# Altium schematic sheet 產學sheet1VS2.SchDoc
size A3
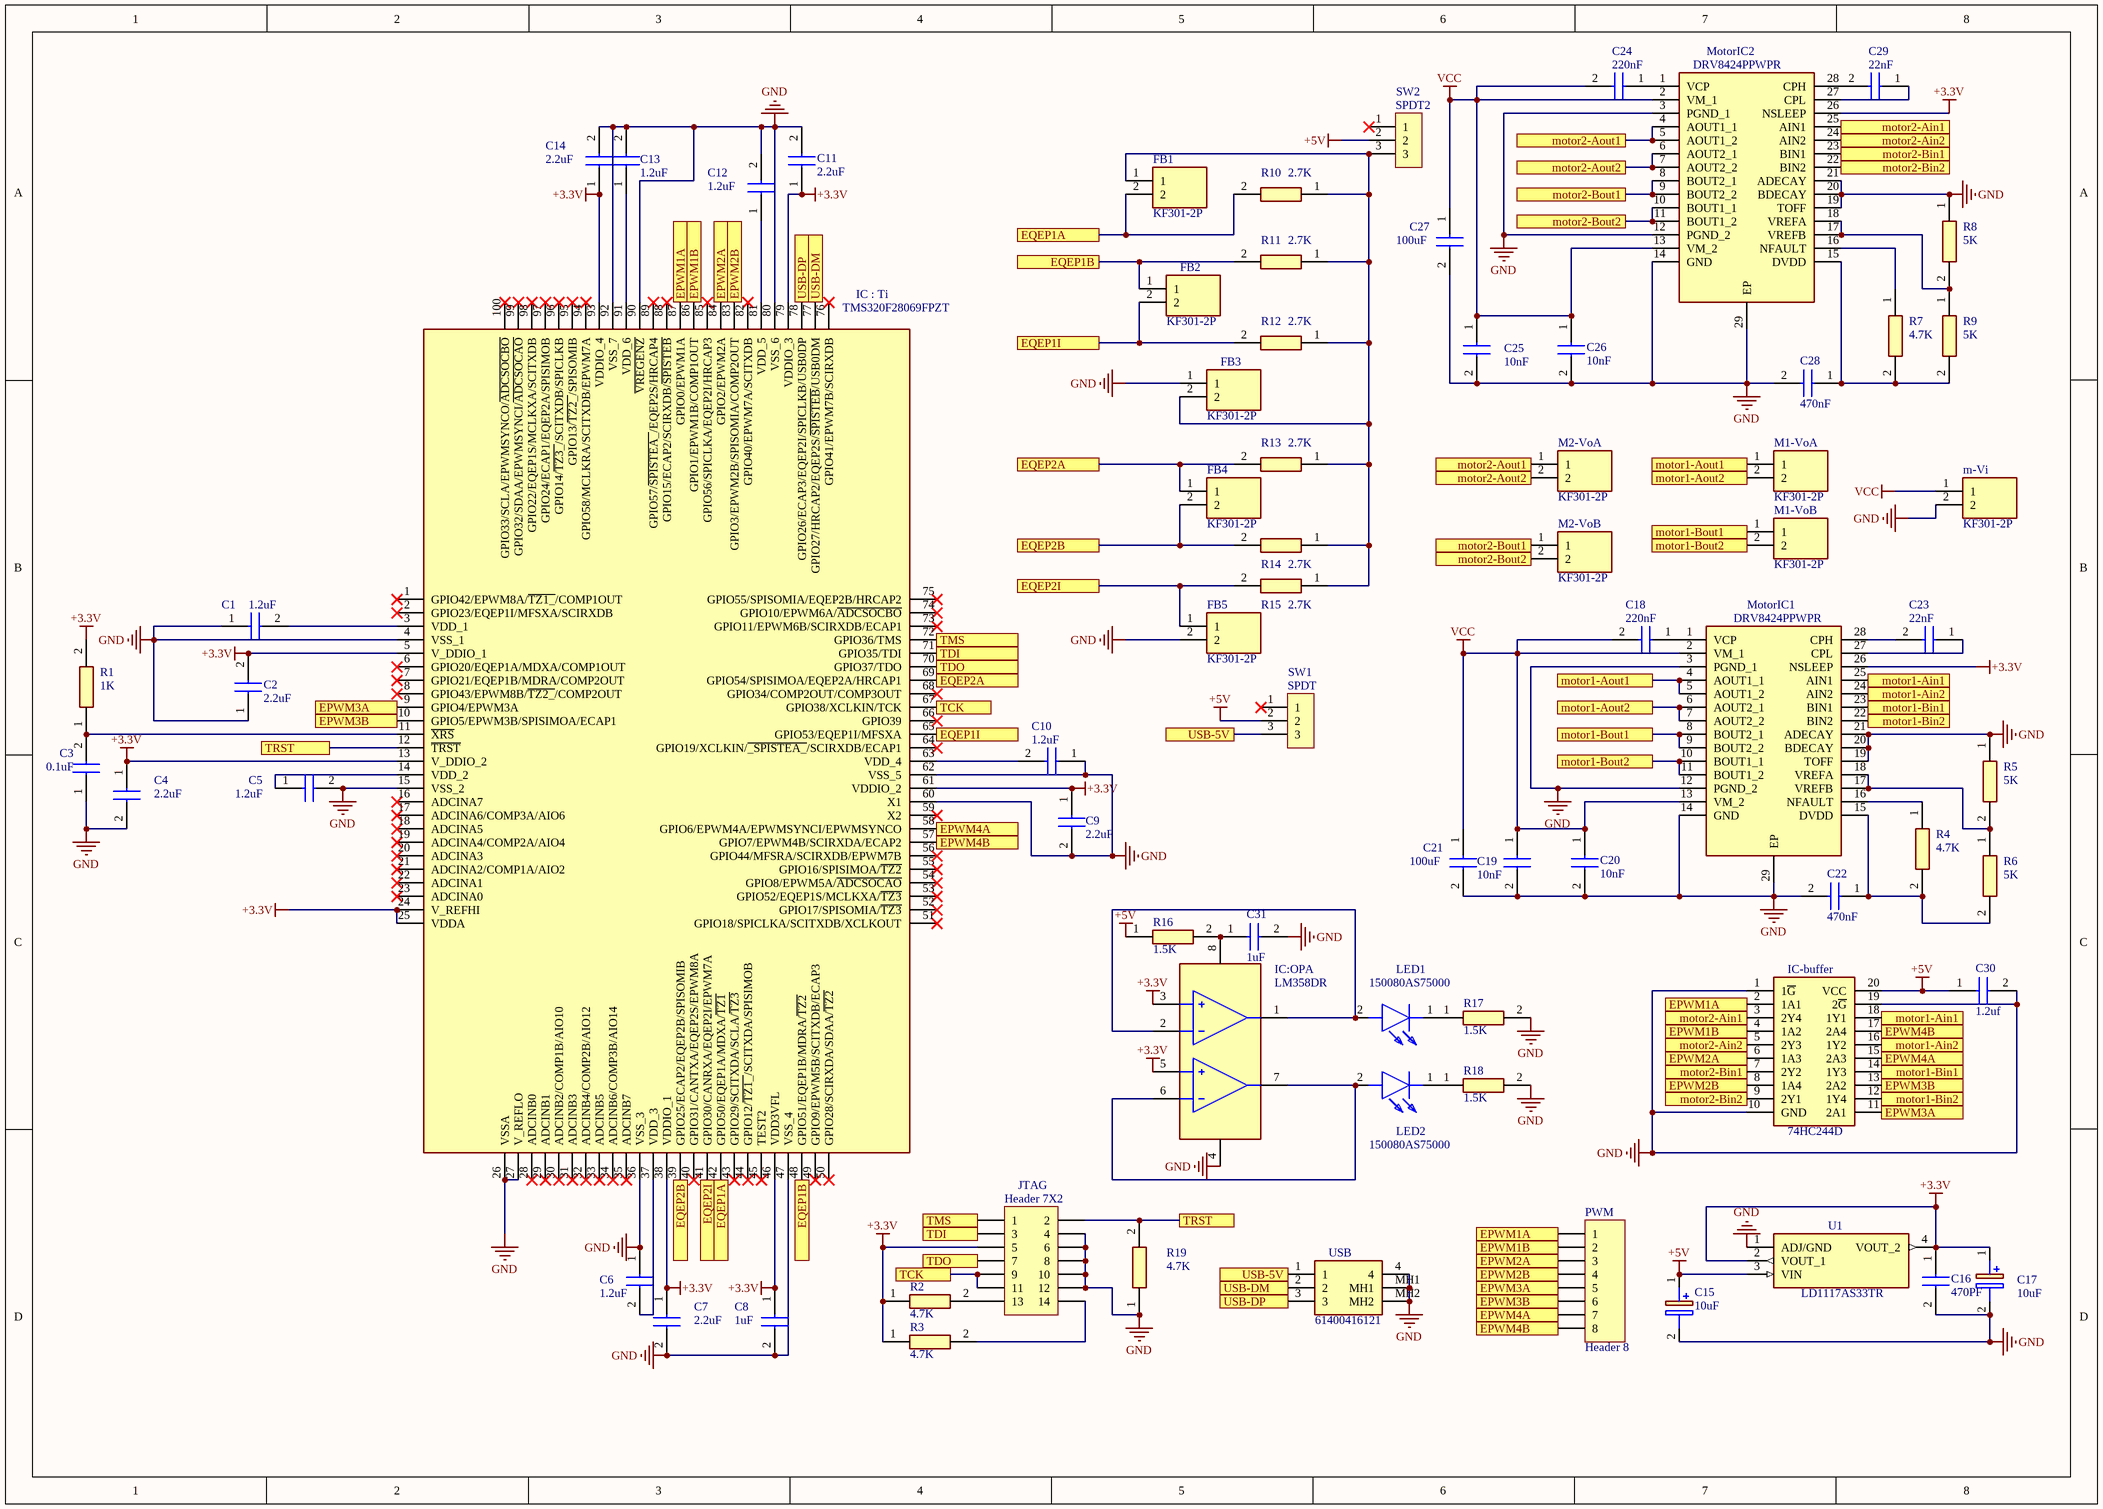
[diagram p0: 產學sheet1VS2.SchDoc]

## Parts
C1  1.2uF  [CAPC2012X140N]
C2  2.2uF  [CAPC2012X140N]
C3  0.1uF  [CAPC2012X140N]
C4  2.2uF  [CAPC2012X140N]
C5  1.2uF  [CAPC2012X140N]
C6  1.2uF  [CAPC2012X140N]
C7  2.2uF  [CAPC2012X140N]
C8  1uF  [C1206]
C9  2.2uF  [CAPC2012X140N]
C10  1.2uF  [CAPC2012X140N]
C11  2.2uF  [CAPC2012X140N]
C12  1.2uF  [CAPC2012X140N]
C13  1.2uF  [CAPC2012X140N]
C14  2.2uF  [CAPC2012X140N]
C15  10uF  [EEE0GA101SR]
C16  470PF  [CAPC2012X140N]
C17  10uF  [EEE0GA101SR]
C18  220nF  [CAPC2012X140N]
C19  10nF  [CAPC2012X140N]
C20  10nF  [CAPC2012X140N]
C21  100uF  [CAPAE1030X1050N]
C22  470nF  [CAPC2012X140N]
C23  22nF  [CAPC2012X140N]
C24  220nF  [CAPC2012X140N]
C25  10nF  [CAPC2012X140N]
C26  10nF  [CAPC2012X140N]
C27  100uF  [CAPAE1030X1050N]
C28  470nF  [CAPC2012X140N]
C29  22nF  [CAPC2012X140N]
C30  1.2uf  [CAPC2012X140N]
C31  1uF  [C1206]
FB1  KF301-2P  [KF3012P]
FB2  KF301-2P  [KF3012P]
FB3  KF301-2P  [KF3012P]
FB4  KF301-2P  [KF3012P]
FB5  KF301-2P  [KF3012P]
IC-buffer  74HC244D  [SOIC127P1030X250-20N]
IC:OPA  LM358DR  [SOIC127P600X175-8N]
IC_:_Ti  TMS320F28069FPZT  [QFP50P1600X1600X160-100N]
JTAG  Header 7X2  [HDR2X7]
LED1  150080AS75000  [LEDC2012X80N]
LED2  150080AS75000  [LEDC2012X80N]
M1-VoA  KF301-2P  [KF3012P]
M1-VoB  KF301-2P  [KF3012P]
M2-VoA  KF301-2P  [KF3012P]
M2-VoB  KF301-2P  [KF3012P]
m-Vi  KF301-2P  [KF3012P]
MotorIC1  DRV8424PPWPR  [SOP65P640X120-29N]
MotorIC2  DRV8424PPWPR  [SOP65P640X120-29N]
PWM  Header 8  [HDR1X8]
R1  1K  [RESC2013X65N]
R2  4.7K  [RESC2013X65N]
R3  4.7K  [RESC2013X65N]
R4  4.7K  [RESC2013X65N]
R5  5K  [RESC2013X65N]
R6  5K  [RESC2013X65N]
R7  4.7K  [RESC2013X65N]
R8  5K  [RESC2013X65N]
R9  5K  [RESC2013X65N]
R10  2.7K  [RESC2013X65N]
R11  2.7K  [RESC2013X65N]
R12  2.7K  [RESC2013X65N]
R13  2.7K  [RESC2013X65N]
R14  2.7K  [RESC2013X65N]
R15  2.7K  [RESC2013X65N]
R16  1.5K  [RESC2013X65N]
R17  1.5K  [RESC2013X65N]
R18  1.5K  [RESC2013X65N]
R19  4.7K  [RESC2013X65N]
SPDT  SW1  [PCBComponent_1]
SPDT2  SW2  [PCBComponent_1]
U1  LD1117AS33TR  [SOT230P700X190-4N]
USB  61400416121  [61400416121]

## Ports
EPWM1A, EPWM1B, EPWM2A, EPWM2B, EPWM3A, EPWM3B, EPWM4A, EPWM4B, EQEP1A, EQEP1B, EQEP1I, EQEP2A, EQEP2B, EQEP2I, motor1-Ain1, motor1-Ain2, motor1-Aout1, motor1-Aout2, motor1-Bin1, motor1-Bin2, motor1-Bout1, motor1-Bout2, motor2-Ain1, motor2-Ain2, motor2-Aout1, motor2-Aout2, motor2-Bin1, motor2-Bin2, motor2-Bout1, motor2-Bout2, TCK, TDI, TDO, TMS, TRST, USB-5V, USB-DM, USB-DP

## Nets
+3.3V: C2.2 C4.1 C7.1 C8.1 C9.1 C11.1 C14.1 C16.1 C17.1(+) IC:OPA.3(IN1+) IC:OPA.5(IN2+) IC_:_Ti.5(V_DDIO_1) IC_:_Ti.13(V_DDIO_2) IC_:_Ti.24(V_REFHI) IC_:_Ti.25(VDDA) IC_:_Ti.38(VDDIO_1) IC_:_Ti.46(VDD3VFL) IC_:_Ti.61(VDDIO_2) IC_:_Ti.79(VDDIO_3) IC_:_Ti.93(VDDIO_4) JTAG.5 MotorIC1.26(NSLEEP) MotorIC2.26(NSLEEP) R1.2(R2) R2.1(R1) R3.1(R1) U1.2(VOUT_1) U1.4(VOUT_2)
+5V: C15.1(+) C30.1 IC-buffer.20(VCC) R16.1(R1) SPDT.2 SPDT2.2 U1.3(VIN)
GND: C1.1 C2.1 C3.1 C4.2 C5.2 C6.1 C7.2 C8.2 C9.2 C10.1 C11.2 C12.2 C13.2 C14.2 C15.2(-) C16.2 C17.2(-) C19.2 C20.2 C21.2(-) C22.2 C25.2 C26.2 C27.2(-) C28.2 C30.2 C31.2 FB3.1 FB5.2 IC-buffer.1(1~{G}) IC-buffer.10(GND) IC-buffer.19(2~{G}) IC:OPA.4(V-) IC_:_Ti.4(VSS_1) IC_:_Ti.15(VSS_2) IC_:_Ti.26(VSSA) IC_:_Ti.27(V_REFLO) IC_:_Ti.36(VSS_3) IC_:_Ti.47(VSS_4) IC_:_Ti.60(X1) IC_:_Ti.62(VSS_5) IC_:_Ti.80(VSS_6) IC_:_Ti.90(~{VREGENZ}) IC_:_Ti.92(VSS_7) JTAG.4 JTAG.6 JTAG.8 JTAG.10 JTAG.12 m-Vi.2 MotorIC1.3(PGND_1) MotorIC1.12(PGND_2) MotorIC1.14(GND) MotorIC1.19(TOFF) MotorIC1.20(BDECAY) MotorIC1.21(ADECAY) MotorIC1.29(EP) MotorIC2.3(PGND_1) MotorIC2.12(PGND_2) MotorIC2.14(GND) MotorIC2.19(TOFF) MotorIC2.20(BDECAY) MotorIC2.21(ADECAY) MotorIC2.29(EP) R5.1(R1) R8.1(R1) R17.2(R2) R18.2(R2) R19.1(R1) U1.1(ADJ/GND) USB.4 USB.MH1 USB.MH2
VCC: C18.2 C19.1 C20.1 C21.1(+) C24.2 C25.1 C26.1 C27.1(+) m-Vi.1 MotorIC1.2(VM_1) MotorIC1.13(VM_2) MotorIC2.2(VM_1) MotorIC2.13(VM_2)
EPWM1A: IC-buffer.2(1A1) IC_:_Ti.87(GPIO0/EPWM1A) PWM.1 ; port EPWM1A
EPWM1B: IC-buffer.4(1A2) IC_:_Ti.86(GPIO1/EPWM1B/COMP1OUT) PWM.2 ; port EPWM1B
EPWM2A: IC-buffer.6(1A3) IC_:_Ti.84(GPIO2/EPWM2A) PWM.3 ; port EPWM2A
EPWM2B: IC-buffer.8(1A4) IC_:_Ti.83(GPIO3/EPWM2B/SPISOMIA/COMP2OUT) PWM.4 ; port EPWM2B
EPWM3A: IC-buffer.11(2A1) IC_:_Ti.9(GPIO4/EPWM3A) PWM.5 ; port EPWM3A
EPWM3B: IC-buffer.13(2A2) IC_:_Ti.10(GPIO5/EPWM3B/SPISIMOA/ECAP1) PWM.6 ; port EPWM3B
EPWM4A: IC-buffer.15(2A3) IC_:_Ti.58(GPIO6/EPWM4A/EPWMSYNCI/EPWMSYNCO) PWM.7 ; port EPWM4A
EPWM4B: IC-buffer.17(2A4) IC_:_Ti.57(GPIO7/EPWM4B/SCIRXDA/ECAP2) PWM.8 ; port EPWM4B
EQEP1A: FB1.2 IC_:_Ti.42(GPIO50/EQEP1A/MDXA/~{TZ1}) R10.2(R2) ; port EQEP1A
EQEP1B: FB2.1 IC_:_Ti.48(GPIO51/EQEP1B/MDRA/~{TZ2}) R11.2(R2) ; port EQEP1B
EQEP1I: FB2.2 IC_:_Ti.65(GPIO53/EQEP1I/MFSXA) R12.2(R2) ; port EQEP1I
EQEP2A: FB4.1 IC_:_Ti.69(GPIO54/SPISIMOA/EQEP2A/HRCAP1) R13.2(R2) ; port EQEP2A
EQEP2B: FB4.2 IC_:_Ti.39(GPIO25/ECAP2/EQEP2B/SPISOMIB) R14.2(R2) ; port EQEP2B
EQEP2I: FB5.1 IC_:_Ti.41(GPIO30/CANRXA/EQEP2I/EPWM7A) R15.2(R2) ; port EQEP2I
motor1-Ain1: IC-buffer.18(1Y1) MotorIC1.25(AIN1) ; port motor1-Ain1
motor1-Ain2: IC-buffer.16(1Y2) MotorIC1.24(AIN2) ; port motor1-Ain2
motor1-Aout1: M1-VoA.1 MotorIC1.4(AOUT1_1) MotorIC1.5(AOUT1_2) ; port motor1-Aout1
motor1-Aout2: M1-VoA.2 MotorIC1.6(AOUT2_1) MotorIC1.7(AOUT2_2) ; port motor1-Aout2
motor1-Bin1: IC-buffer.14(1Y3) MotorIC1.23(BIN1) ; port motor1-Bin1
motor1-Bin2: IC-buffer.12(1Y4) MotorIC1.22(BIN2) ; port motor1-Bin2
motor1-Bout1: M1-VoB.1 MotorIC1.8(BOUT2_1) MotorIC1.9(BOUT2_2) ; port motor1-Bout1
motor1-Bout2: M1-VoB.2 MotorIC1.10(BOUT1_1) MotorIC1.11(BOUT1_2) ; port motor1-Bout2
motor2-Ain1: IC-buffer.3(2Y4) MotorIC2.25(AIN1) ; port motor2-Ain1
motor2-Ain2: IC-buffer.5(2Y3) MotorIC2.24(AIN2) ; port motor2-Ain2
motor2-Aout1: M2-VoA.1 MotorIC2.4(AOUT1_1) MotorIC2.5(AOUT1_2) ; port motor2-Aout1
motor2-Aout2: M2-VoA.2 MotorIC2.6(AOUT2_1) MotorIC2.7(AOUT2_2) ; port motor2-Aout2
motor2-Bin1: IC-buffer.7(2Y2) MotorIC2.23(BIN1) ; port motor2-Bin1
motor2-Bin2: IC-buffer.9(2Y1) MotorIC2.22(BIN2) ; port motor2-Bin2
motor2-Bout1: M2-VoB.1 MotorIC2.8(BOUT2_1) MotorIC2.9(BOUT2_2) ; port motor2-Bout1
motor2-Bout2: M2-VoB.2 MotorIC2.10(BOUT1_1) MotorIC2.11(BOUT1_2) ; port motor2-Bout2
TCK: IC_:_Ti.67(GPIO38/XCLKIN/TCK) JTAG.9 JTAG.11 ; port TCK
TDI: IC_:_Ti.71(GPIO35/TDI) JTAG.3 ; port TDI
TDO: IC_:_Ti.70(GPIO37/TDO) JTAG.7 ; port TDO
TMS: IC_:_Ti.72(GPIO36/TMS) JTAG.1 ; port TMS
TRST: IC_:_Ti.12(~{TRST}) JTAG.2 R19.2(R2) ; port TRST
USB-5V: SPDT.3 USB.1 ; port USB-5V
USB-DM: IC_:_Ti.77(GPIO27/HRCAP2/EQEP2S/~{SPISTEB}/USB0DM) USB.2 ; port USB-DM
USB-DP: IC_:_Ti.78(GPIO26/ECAP3/EQEP2I/SPICLKB/USB0DP) USB.3 ; port USB-DP
NetC1_2: C1.2 IC_:_Ti.3(VDD_1)
NetC3_2: C3.2 IC_:_Ti.11(~{XRS}) R1.1(R1)
NetC5_1: C5.1 IC_:_Ti.14(VDD_2)
NetC6_2: C6.2 IC_:_Ti.37(VDD_3)
NetC10_2: C10.2 IC_:_Ti.63(VDD_4)
NetC12_1: C12.1 IC_:_Ti.81(VDD_5)
NetC13_1: C13.1 IC_:_Ti.91(VDD_6)
NetC18_1: C18.1 MotorIC1.1(VCP)
NetC22_1: C22.1 MotorIC1.15(DVDD) R4.2(R2) R6.2(R2)
NetC23_1: C23.1 MotorIC1.27(CPL)
NetC23_2: C23.2 MotorIC1.28(CPH)
NetC24_1: C24.1 MotorIC2.1(VCP)
NetC28_1: C28.1 MotorIC2.15(DVDD) R7.2(R2) R9.2(R2)
NetC29_1: C29.1 MotorIC2.27(CPL)
NetC29_2: C29.2 MotorIC2.28(CPH)
NetC31_1: C31.1 IC:OPA.8(V+) R16.2(R2)
NetFB1_1: FB1.1 FB3.2 R10.1(R1) R11.1(R1) R12.1(R1) R13.1(R1) R14.1(R1) R15.1(R1) SPDT2.3
NetIC:OPA_1: IC:OPA.1(OUT1) IC:OPA.2(IN1-) LED1.2(A)
NetIC:OPA_6: IC:OPA.6(IN2-) IC:OPA.7(OUT2) LED2.2(A)
NetJTAG_13: JTAG.13 R2.2(R2)
NetJTAG_14: JTAG.14 R3.2(R2)
NetLED1_1: LED1.1(K) R17.1(R1)
NetLED2_1: LED2.1(K) R18.1(R1)
NetMotorIC1_16: MotorIC1.16(NFAULT) R4.1(R1)
NetMotorIC1_17: MotorIC1.17(VREFB) MotorIC1.18(VREFA) R5.2(R2) R6.1(R1)
NetMotorIC2_16: MotorIC2.16(NFAULT) R7.1(R1)
NetMotorIC2_17: MotorIC2.17(VREFB) MotorIC2.18(VREFA) R8.2(R2) R9.1(R1)

Not connected (* = marked no-connect by the designer): IC_:_Ti 1(GPIO42/EPWM8A/~{TZ1_}/COMP1OUT)* 2(GPIO23/EQEP1I/MFSXA/SCIRXDB)* 6(GPIO20/EQEP1A/MDXA/COMP1OUT)* 7(GPIO21/EQEP1B/MDRA/COMP2OUT)* 8(GPIO43/EPWM8B/~{TZ2_}/COMP2OUT)* 16(ADCINA7)* 17(ADCINA6/COMP3A/AIO6)* 18(ADCINA5)* 19(ADCINA4/COMP2A/AIO4)* 20(ADCINA3)* 21(ADCINA2/COMP1A/AIO2)* 22(ADCINA1)* 23(ADCINA0)* 28(ADCINB0)* 29(ADCINB1)* 30(ADCINB2/COMP1B/AIO10)* 31(ADCINB3)* 32(ADCINB4/COMP2B/AIO12)* 33(ADCINB5)* 34(ADCINB6/COMP3B/AIO14)* 35(ADCINB7)* 40(GPIO31/CANTXA/EQEP2S/EPWM8A)* 43(GPIO29/SCITXDA/SCLA/~{TZ3})* 44(GPIO12/~{TZ1_}/SCITXDA/SPISIMOB)* 45(TEST2)* 49(GPIO9/EPWM5B/SCITXDB/ECAP3)* 50(GPIO28/SCIRXDA/SDAA/~{TZ2})* 51(GPIO18/SPICLKA/SCITXDB/XCLKOUT)* 52(GPIO17/SPISOMIA/~{TZ3})* 53(GPIO52/EQEP1S/MCLKXA/~{TZ3})* 54(GPIO8/EPWM5A/~{ADCSOCAO})* 55(GPIO16/SPISIMOA/~{TZ2})* 56(GPIO44/MFSRA/SCIRXDB/EPWM7B)* 59(X2)* 64(GPIO19/XCLKIN/~{_SPISTEA_}/SCIRXDB/ECAP1)* 66(GPIO39)* 68(GPIO34/COMP2OUT/COMP3OUT)* 73(GPIO11/EPWM6B/SCIRXDB/ECAP1)* 74(GPIO10/EPWM6A/~{ADCSOCBO})* 75(GPIO55/SPISOMIA/EQEP2B/HRCAP2)* 76(GPIO41/EPWM7B/SCIRXDB)* 82(GPIO40/EPWM7A/SCITXDB)* 85(GPIO56/SPICLKA/EQEP2I/HRCAP3)* 88(GPIO15/ECAP2/SCIRXDB/~{SPISTEB})* 89(GPIO57/~{SPISTEA_}/EQEP2S/HRCAP4)* 94(GPIO58/MCLKRA/SCITXDB/EPWM7A)* 95(GPIO13/~{TZ2_}/SPISOMIB)* 96(GPIO14/~{TZ3_}/SCITXDB/SPICLKB)* 97(GPIO24/ECAP1/EQEP2A/SPISIMOB)* 98(GPIO22/EQEP1S/MCLKXA/SCITXDB)* 99(GPIO32/SDAA/EPWMSYNCI/~{ADCSOCAO})* 100(GPIO33/SCLA/EPWMSYNCO/~{ADCSOCBO})*; SPDT 1*; SPDT2 1*

## Library data of the parts
C1-C7 C9-C14 C16 C18-C20 C22-C26 C28-C30 = C0805C225K4RAC3123: Capacitor; Manufacturer_Name: KEMET; Datasheet Link: https://componentsearchengine.com/Datasheets/1/C0805C225K4RAC3123.pdf; Height: 1.4mm; Manufacturer_Part_Number: C0805C225K4RAC3123; Mouser Part Number: 80-C0805C225K4R3123; Mouser Price/Stock: https://www.mouser.co.uk/ProductDetail/KEMET/C0805C225K4RAC3123?qs=TJyCevD4CUGNcz2FRWNwVg%3D%3D; Arrow Part Number: C0805C225K4RAC3123; Arrow Price/Stock: https://www.arrow.com/en/products/c0805c225k4rac3123/kemet-corporation
C8 C31 = C1206C105K6RACTU: Capacitor; Manufacturer_Name: KEMET; Datasheet Link: https://content.kemet.com/datasheets/KEM_C1002_X7R_SMD.pdf; Manufacturer_Part_Number: C1206C105K6RACTU; Mouser Part Number: 80-C1206C105K6RACTU; Mouser Price/Stock: https://www.mouser.co.uk/ProductDetail/KEMET/C1206C105K6RACTU?qs=gt1LBUVyoHnikkKVmJ7iSQ%3D%3D
C15 C17 = EEE-FC1V100AR: Capacitor Polarised; Manufacturer_Name: Panasonic; Datasheet Link: http://industrial.panasonic.com/cdbs/www-data/pdf/RDE0000/ABA0000C1169.pdf; Height: 6.5mm; Manufacturer_Part_Number: EEE-FC1V100AR; Mouser Part Number: 667-EEE-FC1V100AR; Mouser Price/Stock: https://www.mouser.co.uk/ProductDetail/Panasonic/EEE-FC1V100AR/?qs=d1CqaRUMZD9GQhdQwE2xcQ%3D%3D; Arrow Part Number: EEE-FC1V100AR; Arrow Price/Stock: http://www.arrow.com/en/products/eee-fc1v100ar/panasonic
C21 C27 = EDT107M050S9PAA: Capacitor; Manufacturer_Name: KEMET; Datasheet Link: https://ms.componentsearchengine.com/Datasheets/2/EDT107M050S9PAA.pdf; Height: 10.5mm; Manufacturer_Part_Number: EDT107M050S9PAA; Mouser Part Number: 80-EDT107M050S9PAA; Mouser Price/Stock: https://www.mouser.co.uk/ProductDetail/KEMET/EDT107M050S9PAA?qs=E9QF1UCAUX4foN0Q8i5wVQ%3D%3D; Arrow Part Number: EDT107M050S9PAA; Arrow Price/Stock: https://www.arrow.com/en/products/edt107m050s9paa/kemet-corporation?region=nac
FB1-FB5 M1-VoA M1-VoB M2-VoA M2-VoB m-Vi = KF301-2P: Connector; Manufacturer_Name: Handson Technology; Datasheet Link: http://www.handsontec.com/dataspecs/terminal%20block-5mm.pdf; Height: 10mm; Manufacturer_Part_Number: KF301-2P
IC-buffer = 74HC244D: Integrated Circuit; Manufacturer_Name: Toshiba; Datasheet Link: https://www.arrow.com/en/products/74hc244d/toshiba; Height: 2.5mm; Manufacturer_Part_Number: 74HC244D; Mouser Part Number: 757-74HC244D; Mouser Price/Stock: https://www.mouser.co.uk/ProductDetail/Toshiba/74HC244D?qs=7EBvPakHacWwVm6mPM9mPg%3D%3D; Arrow Part Number: 74HC244D; Arrow Price/Stock: https://www.arrow.com/en/products/74hc244d/toshiba?region=nac
IC:OPA = LM358DR: Integrated Circuit; Manufacturer_Name: Texas Instruments; Datasheet Link: https://www.ti.com/lit/ds/symlink/lm358.pdf?ts=1593170624750&ref_url=https%253A%252F%252Fwww.ti.com%252Fstore%252Fti%252Fen%252Fp%252Fproduct%252F%253Fp%253DLM358DR%2526keyMatch%253DLM358DR%2526tisearch%253DSearch-EN-everything%2526usecase%253DOPN; Height: 1.75mm; Manufacturer_Part_Number: LM358DR; Mouser Part Number: 595-LM358DR; Mouser Price/Stock: https://www.mouser.co.uk/ProductDetail/Texas-Instruments/LM358DR?qs=Zu35EjizYSSY6pJ37yjmHA%3D%3D; Arrow Part Number: LM358DR; Arrow Price/Stock: https://www.arrow.com/en/products/lm358dr/texas-instruments?region=nac
IC_:_Ti = TMS320F28069FPZT: Integrated Circuit; Manufacturer_Name: Texas Instruments; Datasheet Link: http://www.ti.com/lit/gpn/tms320f28069f; Height: 1.6mm; Manufacturer_Part_Number: TMS320F28069FPZT; Mouser Part Number: 595-TMS320F28069FPZT; Mouser Price/Stock: https://www.mouser.co.uk/ProductDetail/Texas-Instruments/TMS320F28069FPZT?qs=VMlqFFbv3sSkglMISrjiog%3D%3D; Arrow Part Number: TMS320F28069FPZT; Arrow Price/Stock: https://www.arrow.com/en/products/tms320f28069fpzt/texas-instruments
JTAG = Header 7X2: Header, 7-Pin, Dual row; LatestRevisionDate: 17-Jul-2002; LatestRevisionNote: Re-released for DXP Platform.; Publisher: Altium Limited
LED1 LED2 = 150080AS75000: LED; Manufacturer_Name: Wurth Elektronik; Datasheet Link: https://componentsearchengine.com/Datasheets/2/150080AS75000.pdf; Height: 0.8mm; Manufacturer_Part_Number: 150080AS75000; Mouser Part Number: 710-150080AS75000; Mouser Price/Stock: https://www.mouser.co.uk/ProductDetail/Wurth-Elektronik/150080AS75000?qs=sPbYRqrBIVkeO9bp3fBTig%3D%3D
MotorIC1 MotorIC2 = DRV8424PPWPR: Integrated Circuit; Manufacturer_Name: Texas Instruments; Datasheet Link: https://www.ti.com/lit/ds/symlink/drv8424e.pdf?ts=1621759599316&ref_url=https%253A%252F%252Fwww.mouser.de%252F; Height: 1.2mm; Manufacturer_Part_Number: DRV8424PPWPR; Mouser Part Number: 595-DRV8424PPWPR; Mouser Price/Stock: https://www.mouser.co.uk/ProductDetail/Texas-Instruments/DRV8424PPWPR?qs=CiayqK2gdcKHVqboqYVmRA%3D%3D; Arrow Part Number: DRV8424PPWPR; Arrow Price/Stock: https://www.arrow.com/en/products/drv8424ppwpr/texas-instruments?region=nac
PWM = Header 8: Header, 8-Pin; LatestRevisionDate: 17-Jul-2002; LatestRevisionNote: Re-released for DXP Platform.; Publisher: Altium Limited
R1-R19 = ERJ-6GEYJ102V: Resistor; Manufacturer_Name: Panasonic; Manufacturer_Part_Number: ERJ-6GEYJ102V; Mouser Part Number: 667-ERJ-6GEYJ102V; Mouser Price/Stock: https://www.mouser.co.uk/ProductDetail/Panasonic/ERJ-6GEYJ102V?qs=tQNqqtTOejLZQ8YYVXgJXw%3D%3D; Arrow Part Number: ERJ-6GEYJ102V; Arrow Price/Stock: https://www.arrow.com/en/products/erj-6geyj102v/panasonic?region=europe
SPDT SPDT2 = Component_1
U1 = LD1117AS33TR: Power Supply; Manufacturer_Name: STMicroelectronics; Datasheet Link: https://4donline.ihs.com/images/VipMasterIC/IC/SGST/SGSTS49356/SGSTS49356-1.pdf?hkey=6D3A4C79FDBF58556ACFDE234799DDF0; Height: 1.9mm; Manufacturer_Part_Number: LD1117AS33TR; Mouser Part Number: 511-LD1117AS33; Mouser Price/Stock: https://www.mouser.co.uk/ProductDetail/STMicroelectronics/LD1117AS33TR?qs=C3bf%2FVrkE5CoDDd7wyn%252BaQ%3D%3D; Arrow Part Number: LD1117AS33TR; Arrow Price/Stock: https://www.arrow.com/en/products/ld1117as33tr/stmicroelectronics?region=nac
USB = 61400416121: Connector; Manufacturer_Name: Wurth Elektronik; Datasheet Link: https://www.we-online.com/catalog/datasheet/61400416121.pdf; Height: 11.25mm; Manufacturer_Part_Number: 61400416121; Mouser Part Number: 710-61400416121; Mouser Price/Stock: https://www.mouser.co.uk/ProductDetail/Wurth-Elektronik/61400416121?qs=rS3zZhy2AQOfJvFesH7XZA%3D%3D